# EasyEDA Pro project 万用表.eprj, schematic Schematic1

## Sheets
1 core: Board Name: 1.0版本-大表笔; Create Date: 2025-03-25; Page Name: core; Project Name: 天空星-简易数字万用表拓展版; Schematic Name: Schematic1; Update Date: 2025-03-25; Company: 嘉立创EDA; Page Size: A4; Version: V1.0
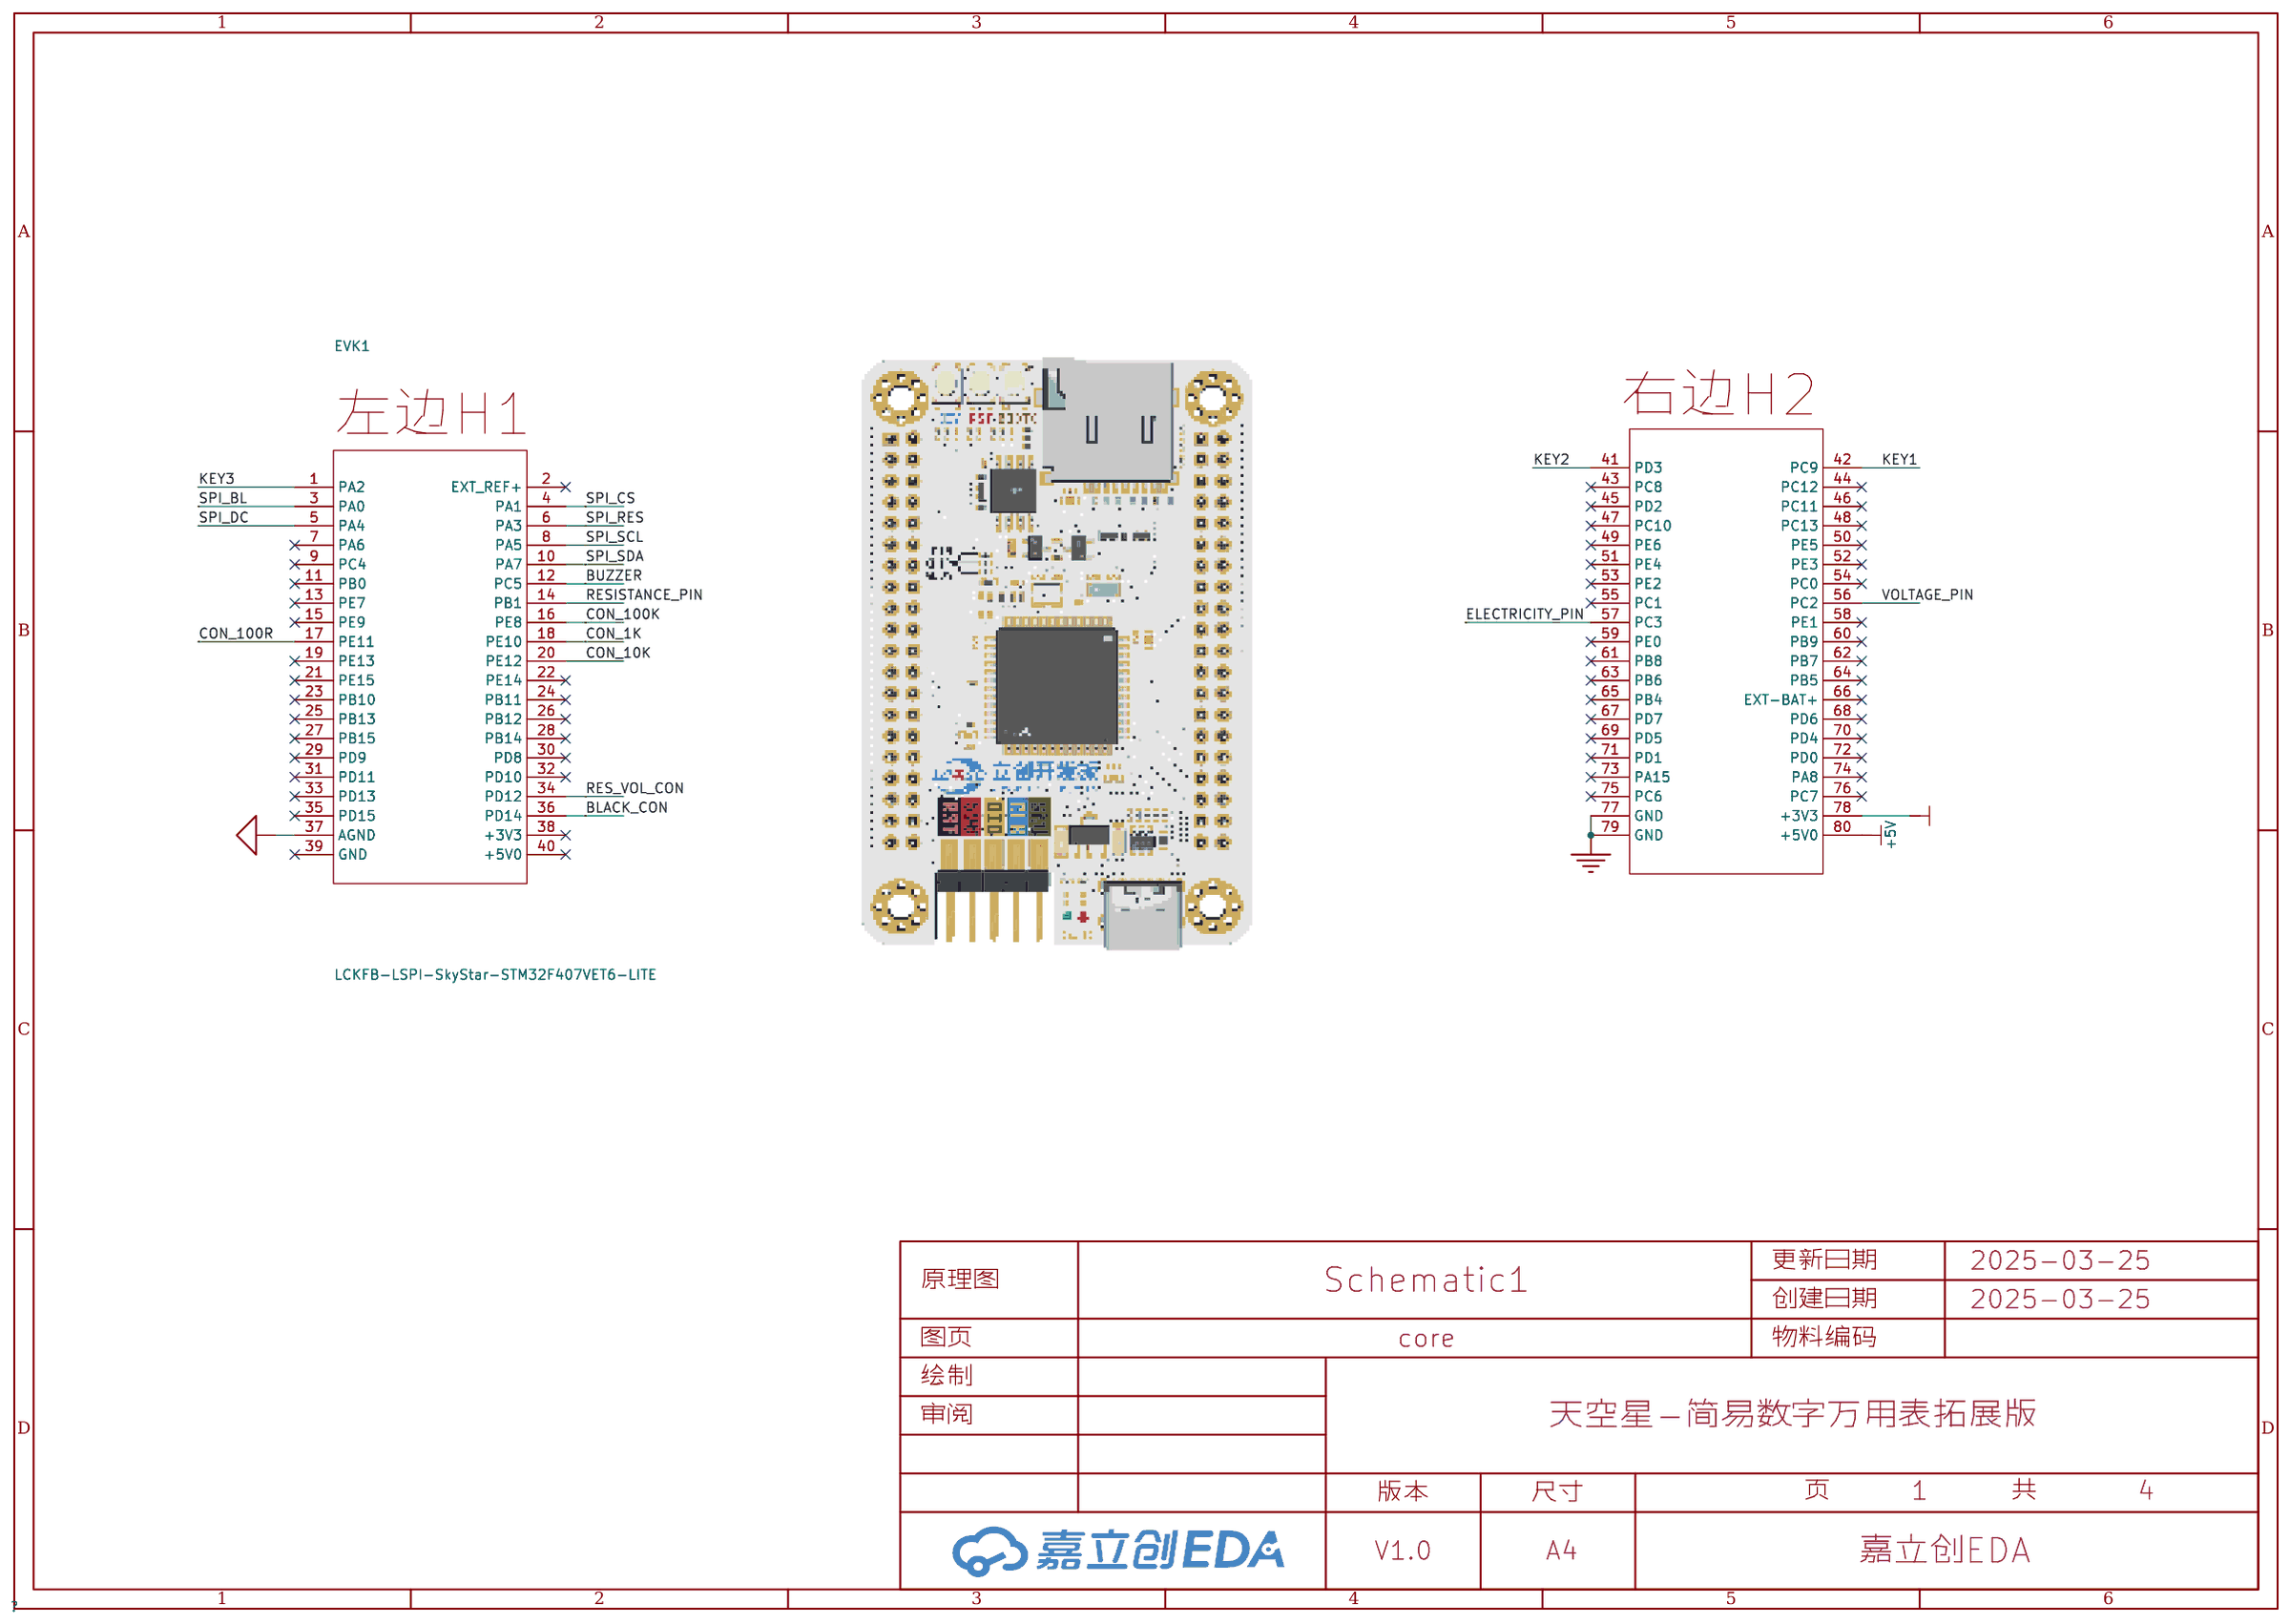
[diagram p0: core]
2 peripheral: Board Name: Board1; Page Name: peripheral
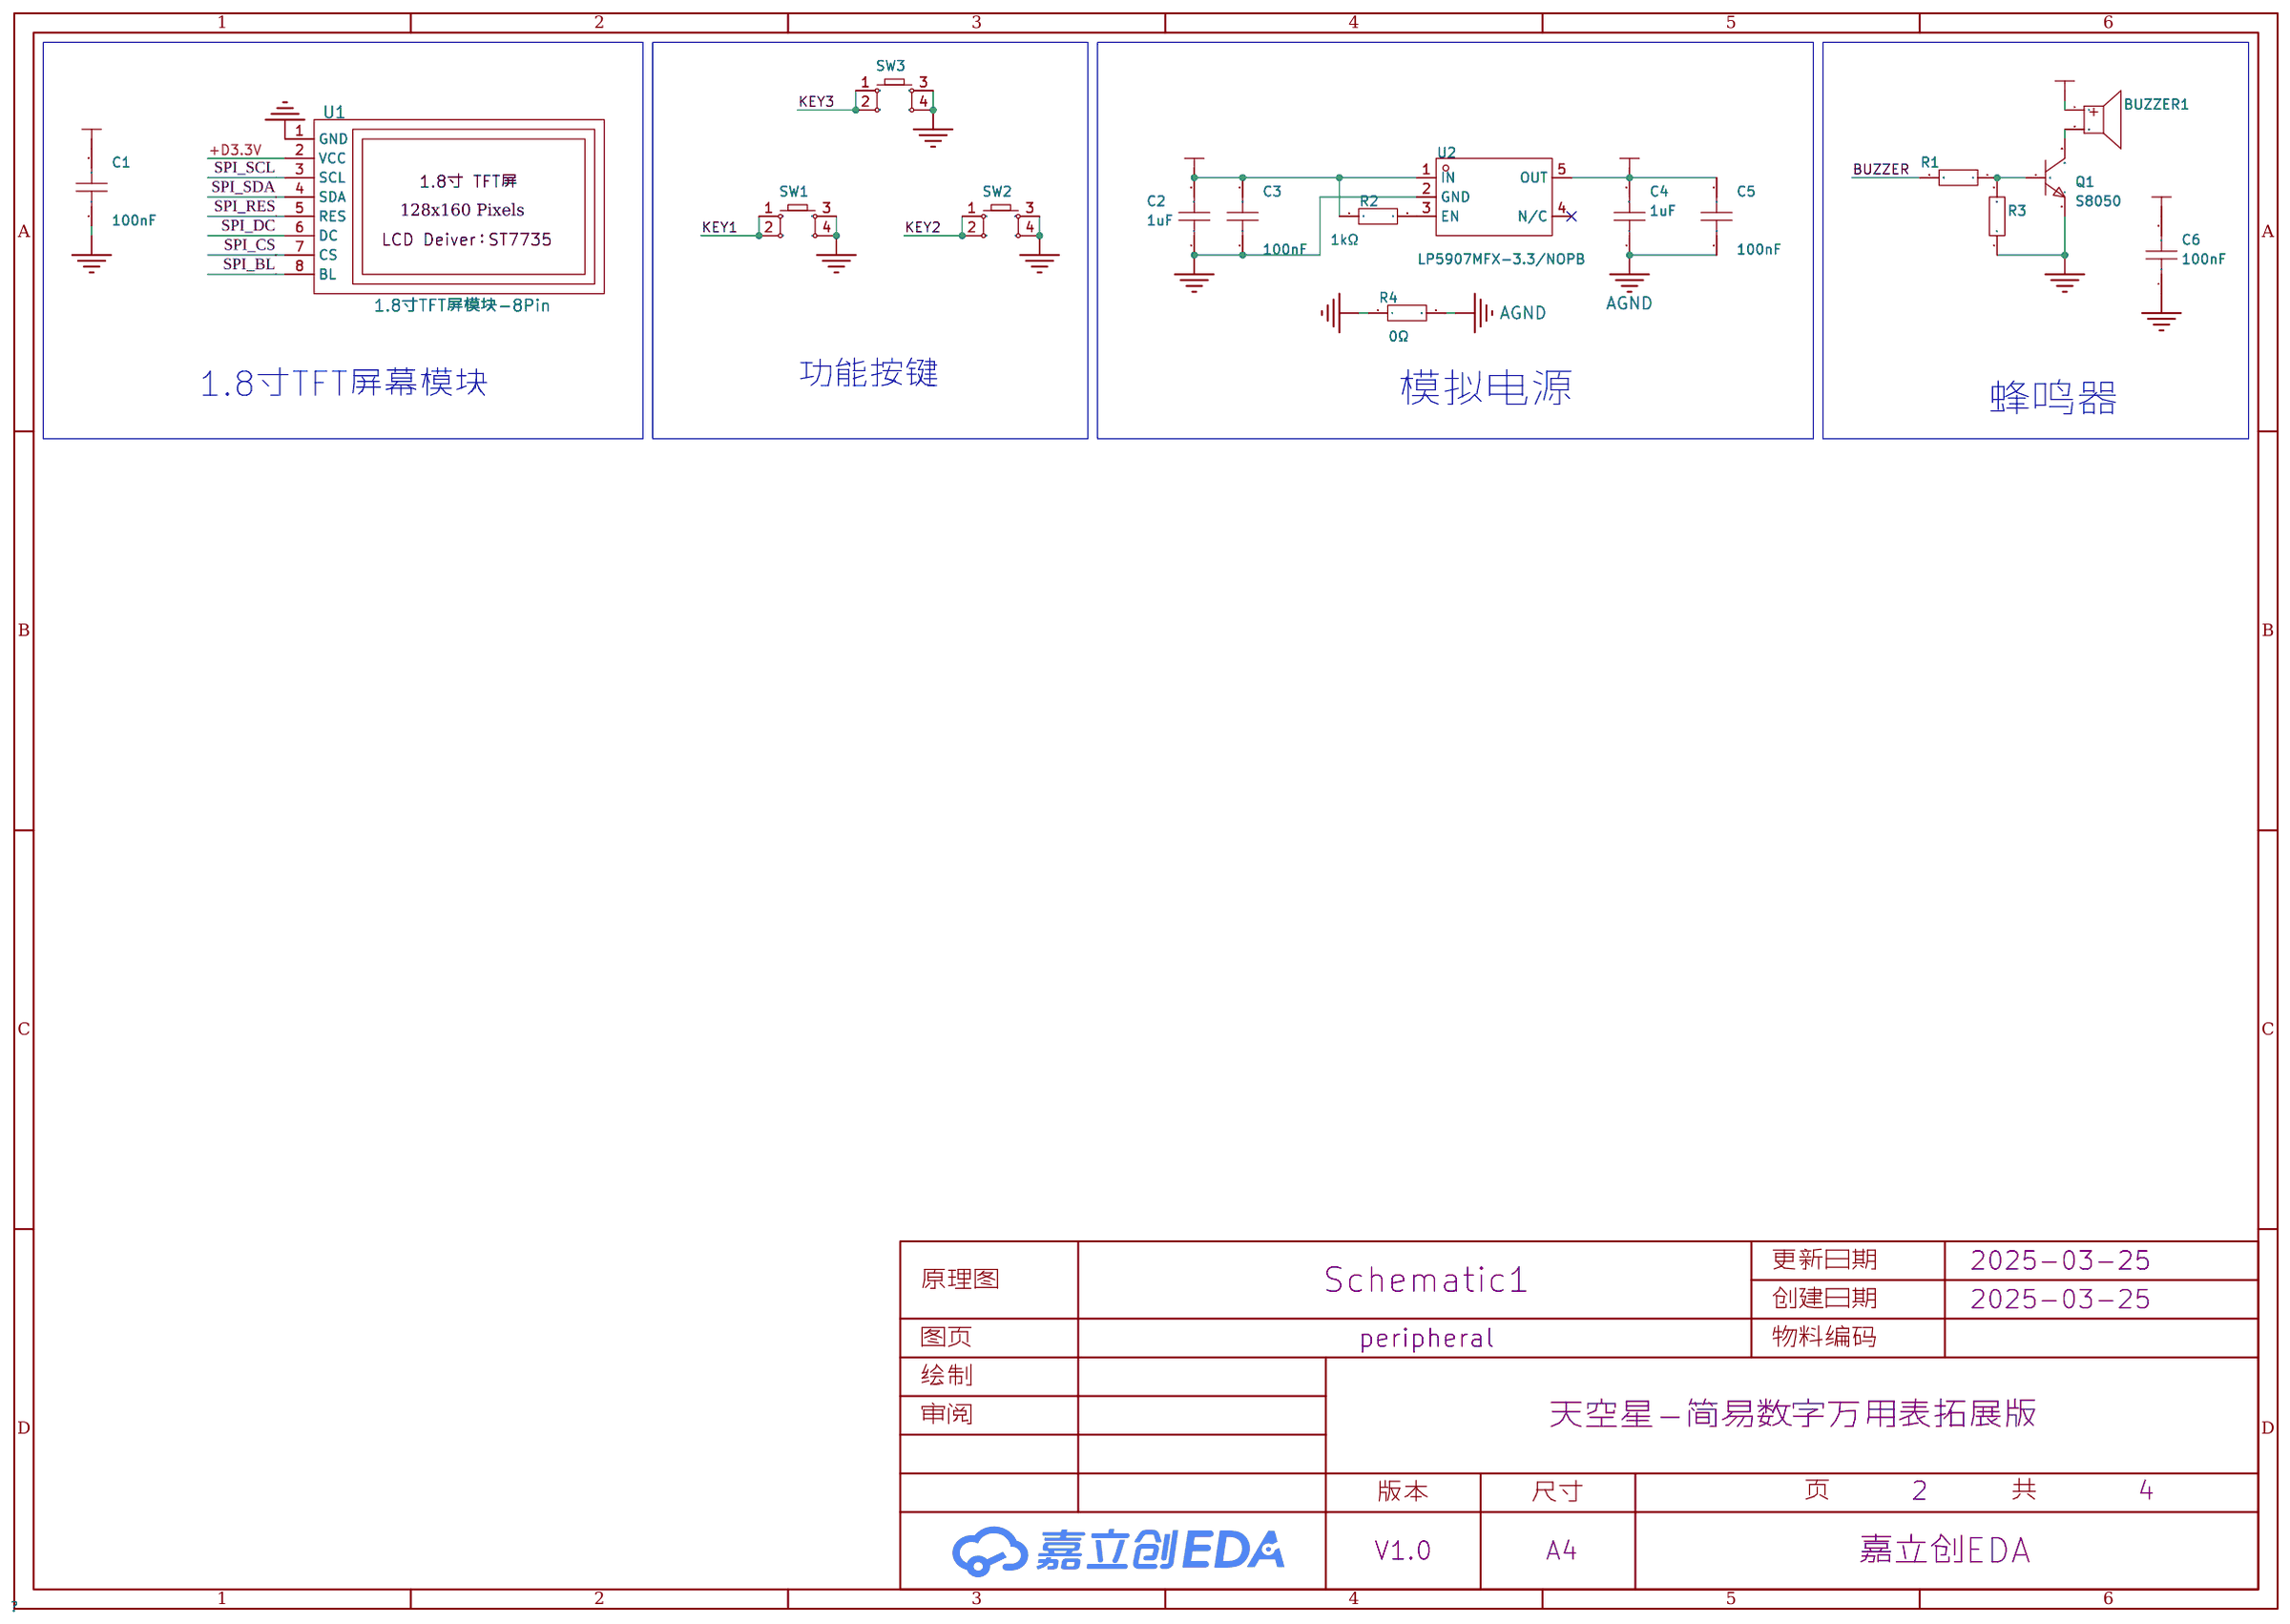
[diagram p1: peripheral]
3 control: Page Name: control
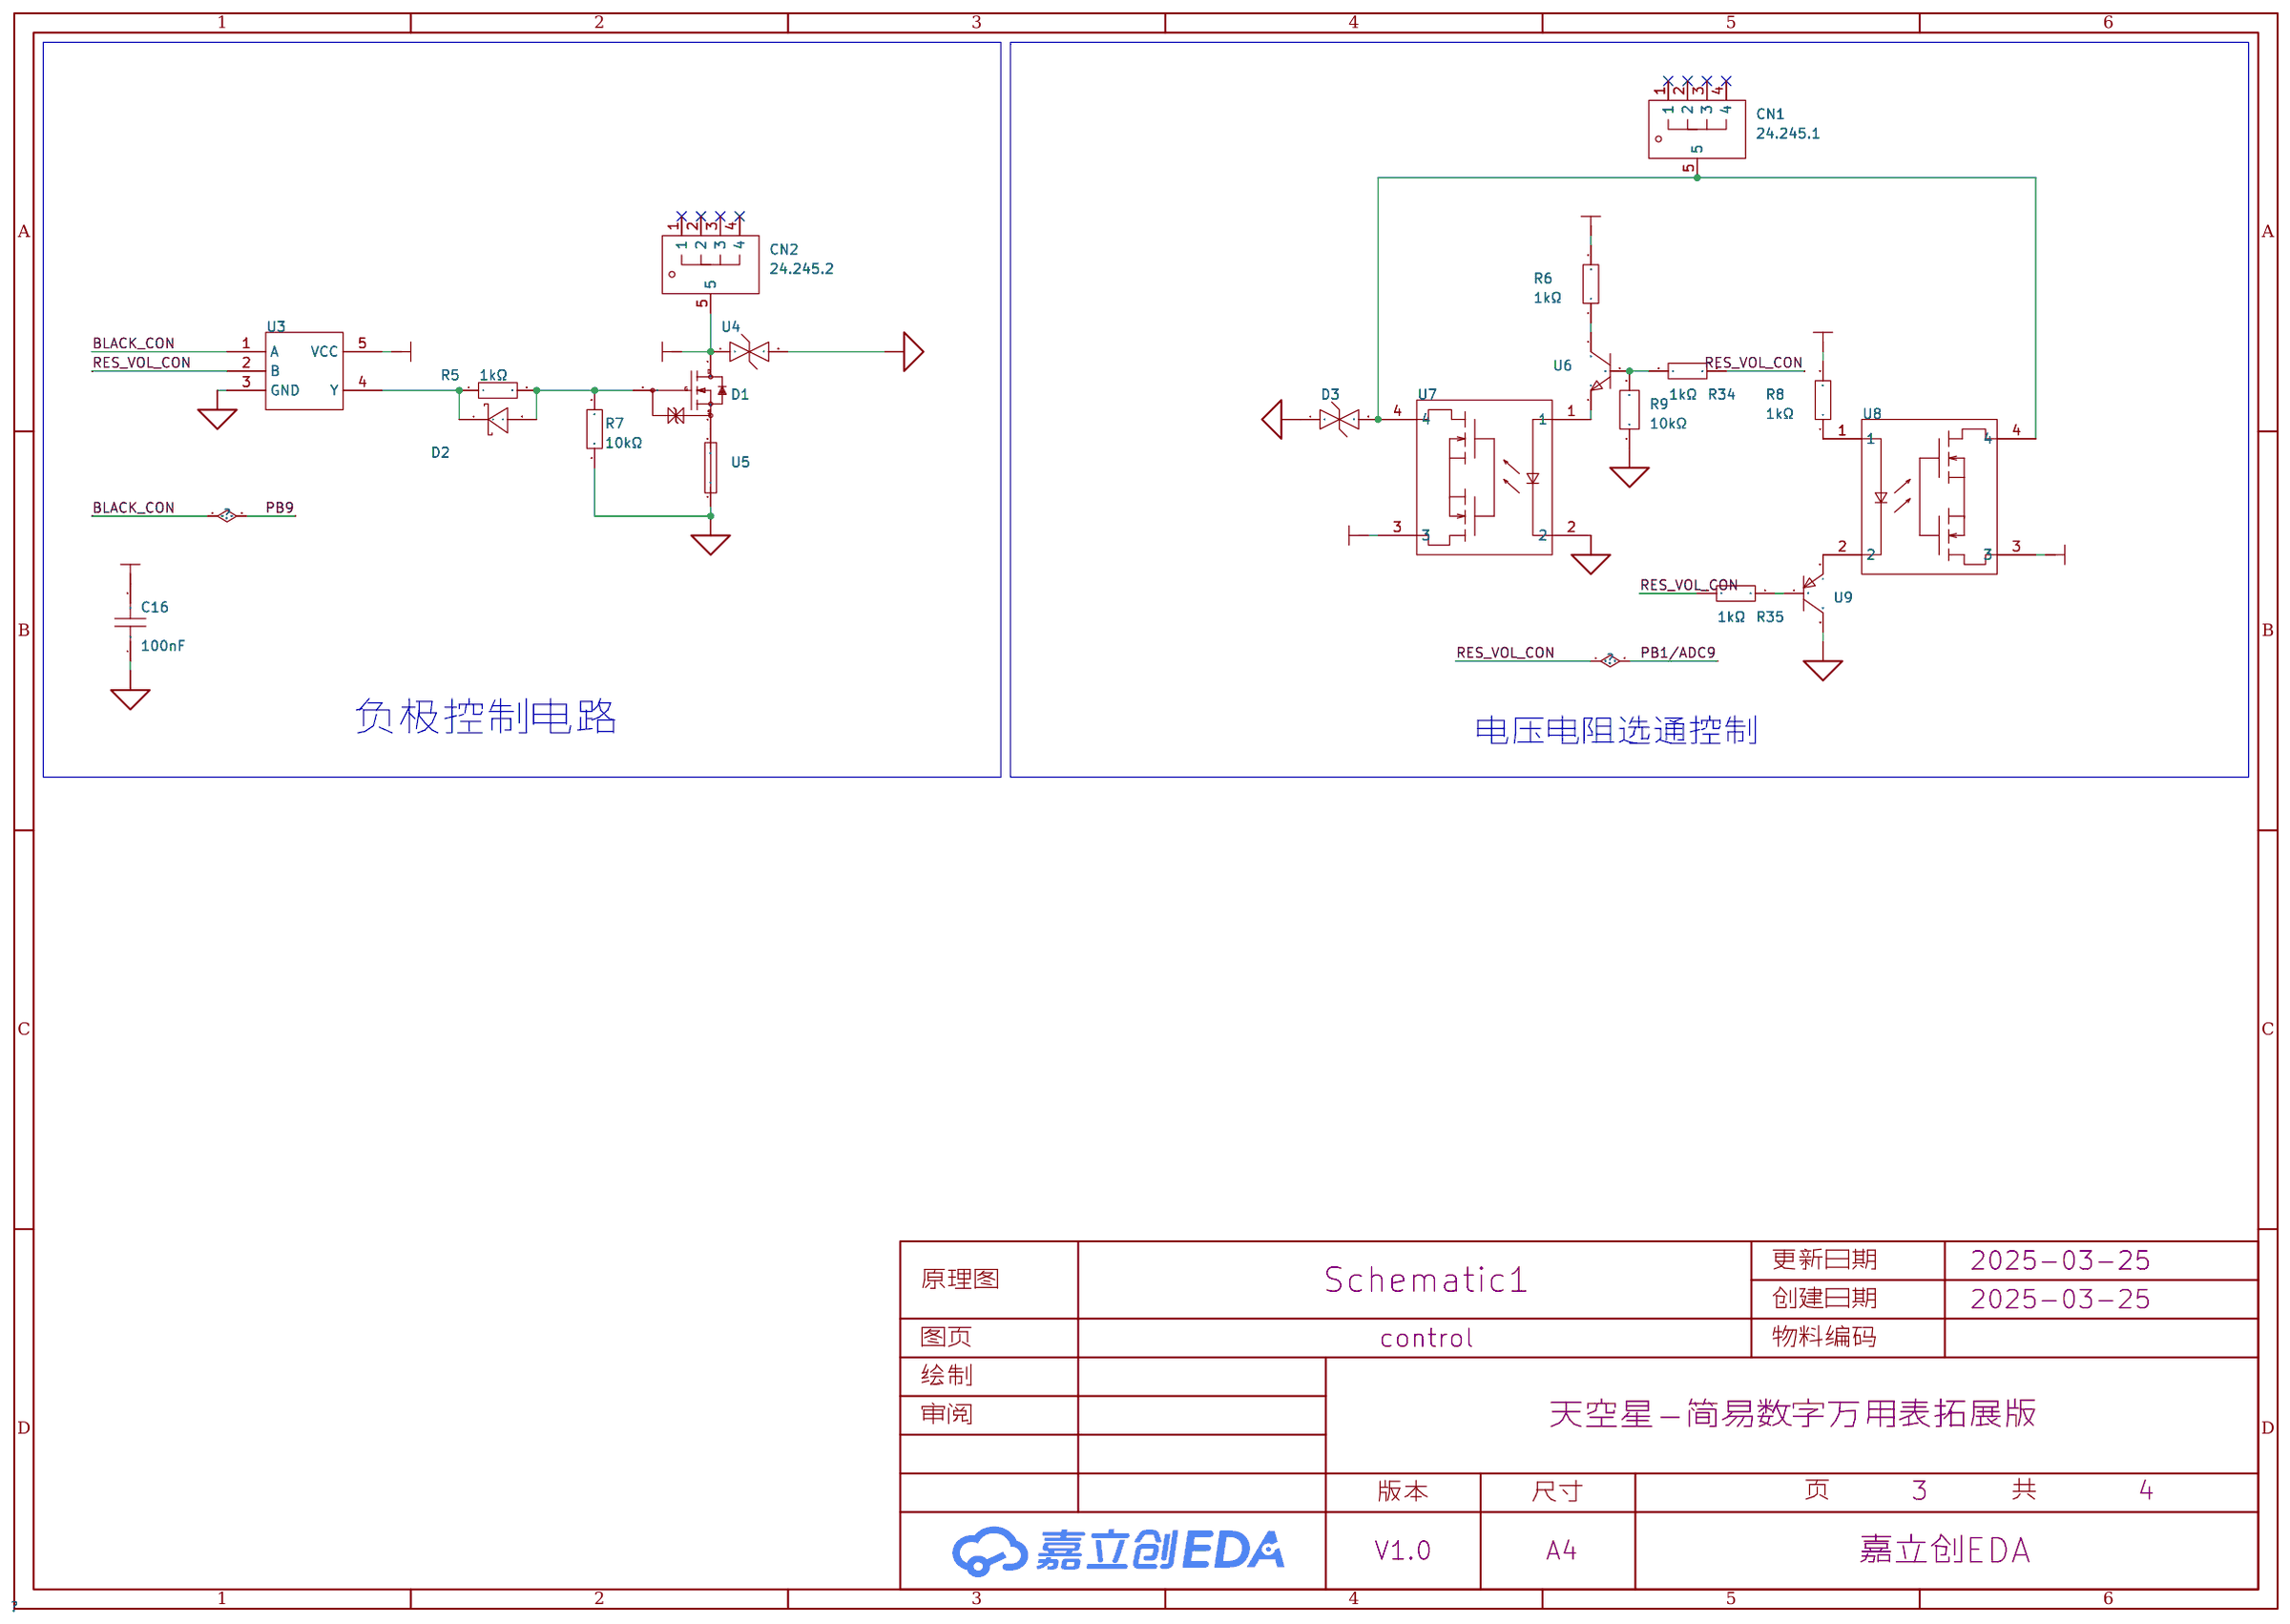
[diagram p2: control]
4 measure: Board Name: Board1; Page Name: measure
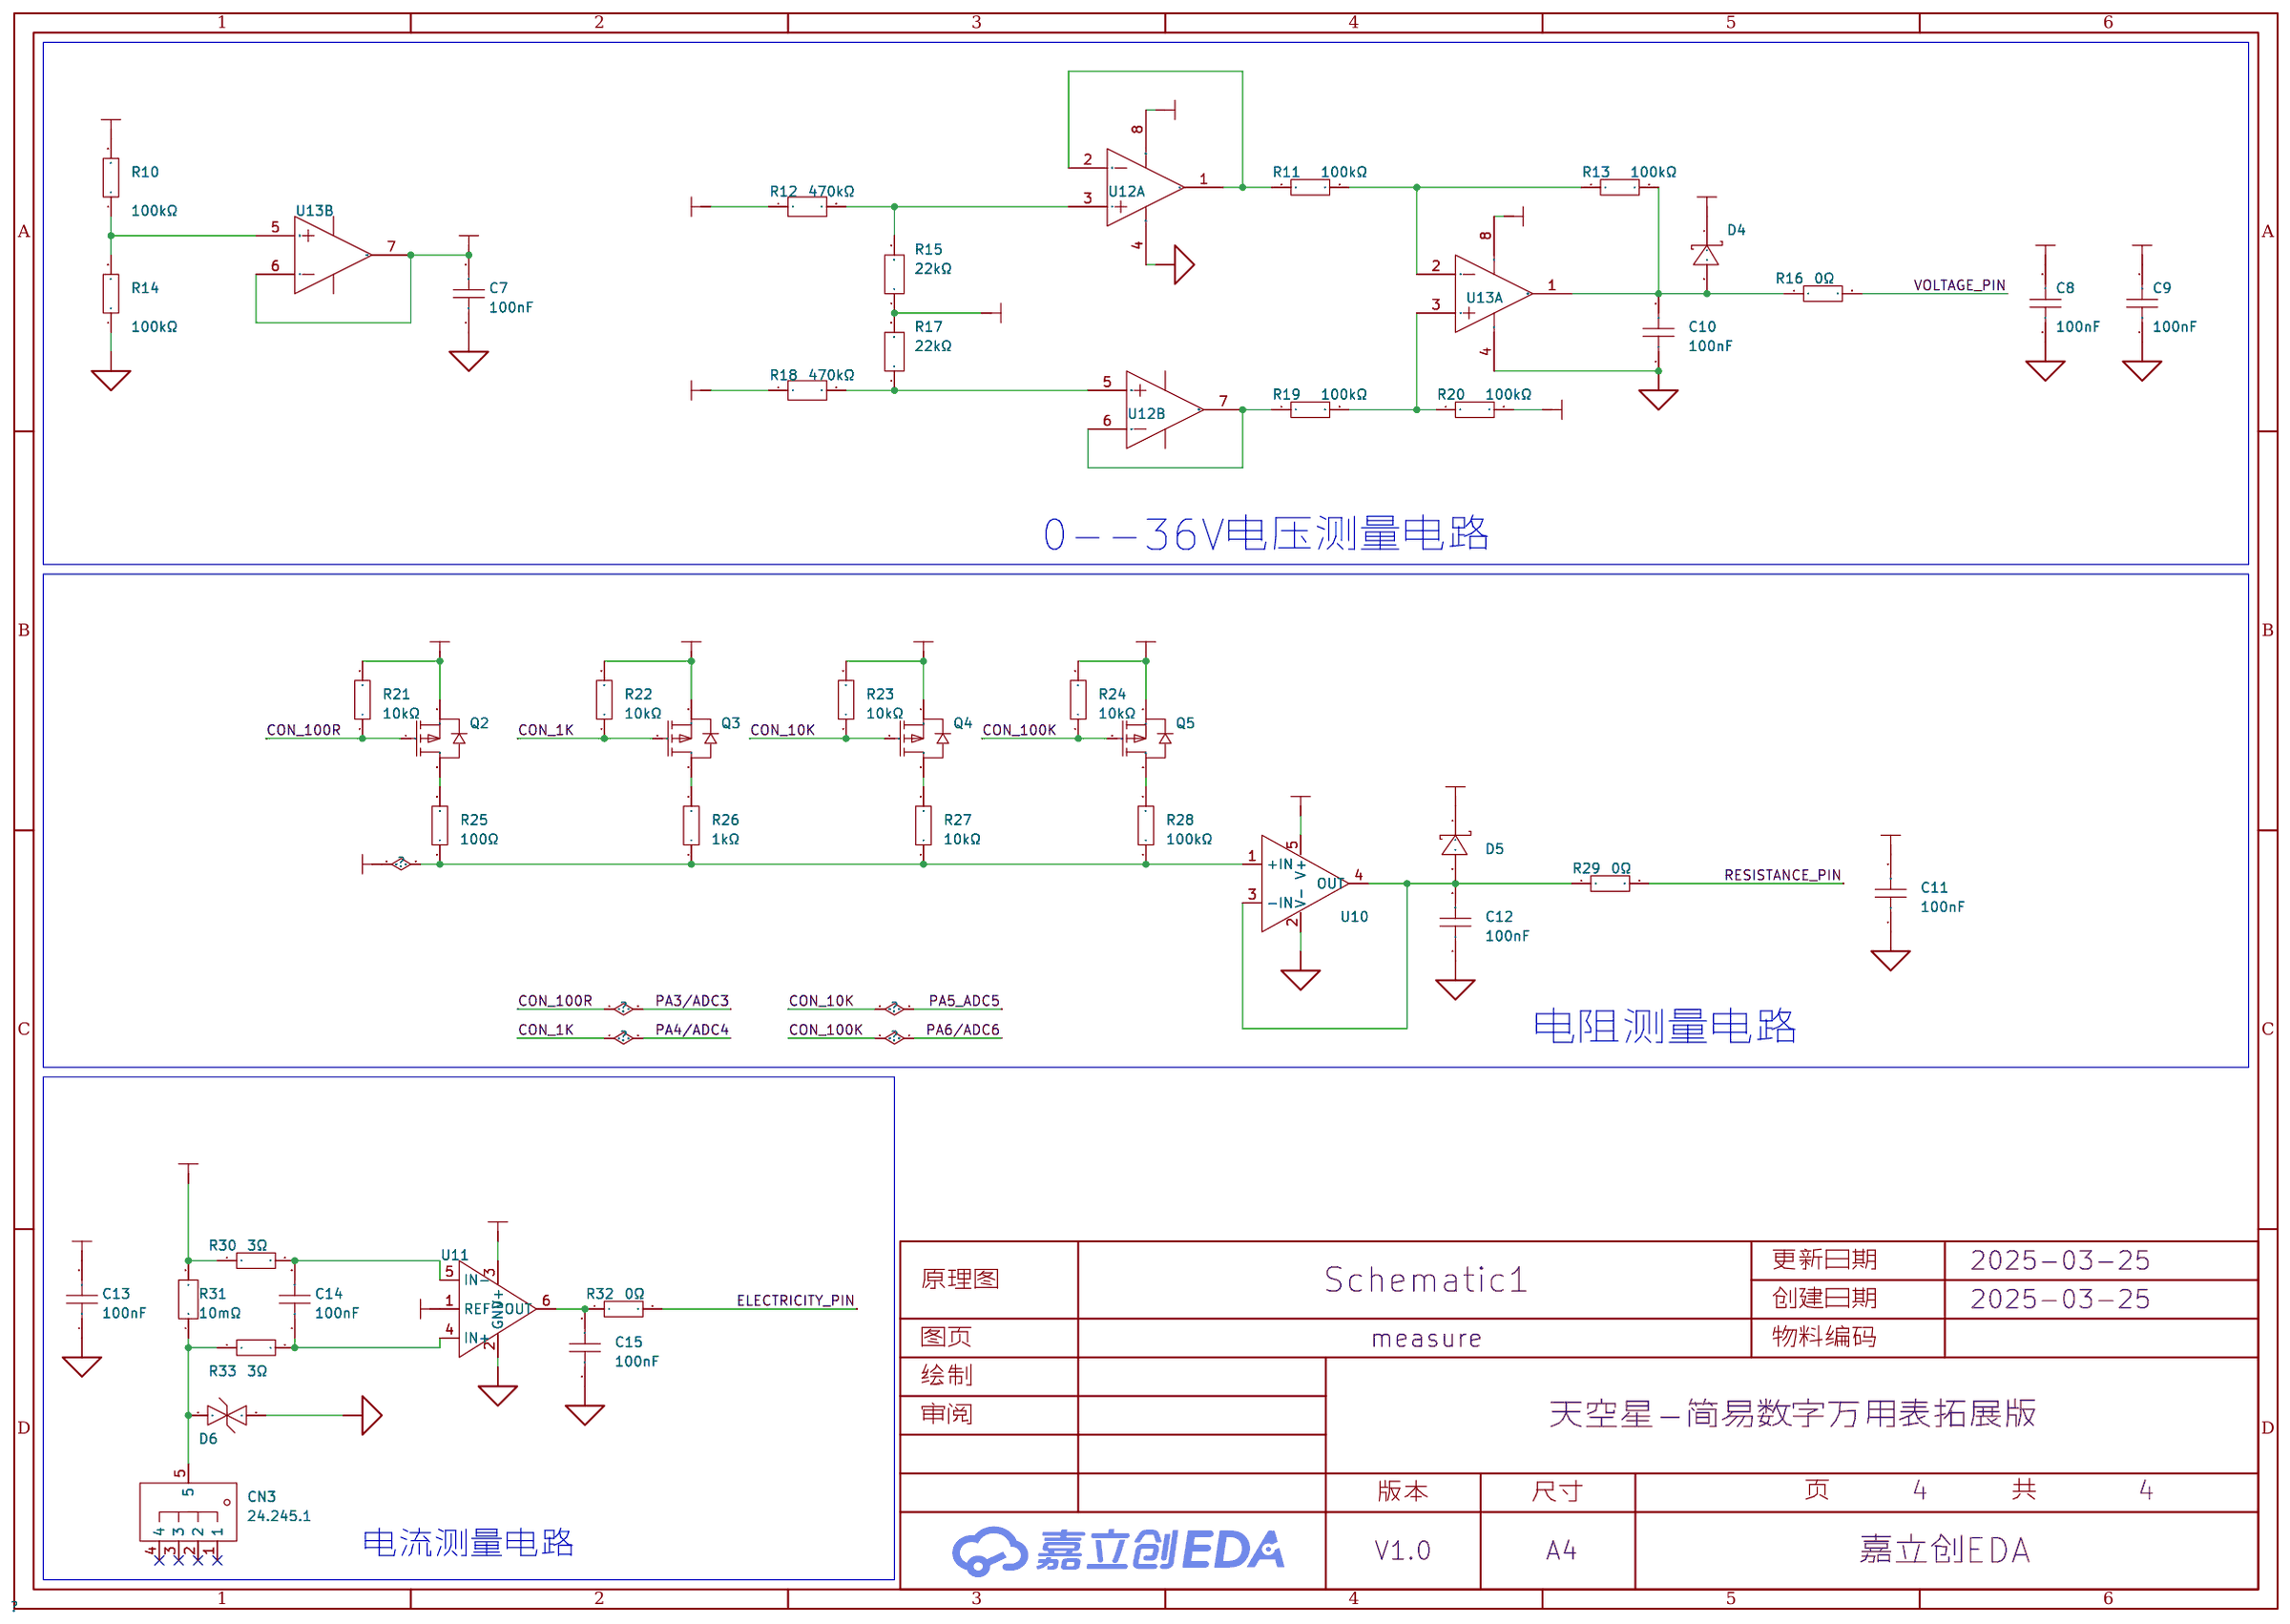
[diagram p3: measure]

## Parts
sheet control
C16  100nF  [C0603]
CN1  24.245.1  [ANT-TH_L33.0-W12.0_RED]
CN2  24.245.2  [ANT-TH_L33.0-W12.0_BLACK]
D1  SJD12C40L01  [SOD-123_L2.8-W1.8-LS3.7-BI]
D2  1N5819WS  [SOD-323_L1.8-W1.3-LS2.5-RD]
D3  SJD12C40L01  [SOD-123_L2.8-W1.8-LS3.7-BI]
R5  1kΩ  [R0603]
R6  1kΩ  [R0603]
R7  10kΩ  [R0603]
R8  1kΩ  [R0603]
R9  10kΩ  [R0603]
R34  1kΩ  [R0603]
R35  1kΩ  [R0603]
U3  SN74AHC1G08DBVR  [SOT-23-5_L3.0-W1.7-P0.95-LS2.8-BR]
U4  2N7002K  [SOT-23-3_L2.9-W1.3-P1.90-LS2.4-BL-1]
U5  BSMD0603-010-36V  [F0603]
U6  SS8050  [SOT-23-3_L2.9-W1.3-P1.90-LS2.4-BR]
U7  GAQY212GSX  [SOP-4_L4.3-W4.4-P2.54-LS6.8-TR]
U8  GAQY212GSX  [SOP-4_L4.3-W4.4-P2.54-LS6.8-TR]
U9  SS8550  [SOT-23-3_L2.9-W1.3-P1.90-LS2.4-BR]
sheet core
EVK1  LCKFB-LSPI-SkyStar-STM32F407VET6-LITE  [COMM-TH_LCKFB-LSPI-SKYSTAR-STM32F407VET6-LITE]
sheet measure
C7  100nF  [C0603]
C8  100nF  [C0603]
C9  100nF  [C0603]
C10  100nF  [C0603]
C11  100nF  [C0603]
C12  100nF  [C0603]
C13  100nF  [C0603]
C14  100nF  [C0603]
C15  100nF  [C0603]
CN3  24.245.1  [ANT-TH_L33.0-W12.0_RED]
D4  1N5819WS  [SOD-323_L1.8-W1.3-LS2.5-RD]
D5  1N5819WS  [SOD-323_L1.8-W1.3-LS2.5-RD]
D6  SJD12C40L01  [SOD-123_L2.8-W1.8-LS3.7-BI]
Q2  AO3401  [SOT-23-3_L2.9-W1.4-P1.90-LS2.6-BR]
Q3  AO3401  [SOT-23-3_L2.9-W1.4-P1.90-LS2.6-BR]
Q4  AO3401  [SOT-23-3_L2.9-W1.4-P1.90-LS2.6-BR]
Q5  AO3401  [SOT-23-3_L2.9-W1.4-P1.90-LS2.6-BR]
R10  100kΩ  [R0603]
R11  100kΩ  [R0603]
R12  470kΩ  [R0603]
R13  100kΩ  [R0603]
R14  100kΩ  [R0603]
R15  22kΩ  [R0603]
R16  0Ω  [R0603]
R17  22kΩ  [R0603]
R18  470kΩ  [R0603]
R19  100kΩ  [R0603]
R20  100kΩ  [R0603]
R21  10kΩ  [R0603]
R22  10kΩ  [R0603]
R23  10kΩ  [R0603]
R24  10kΩ  [R0603]
R25  100Ω  [R0603]
R26  1kΩ  [R0603]
R27  10kΩ  [R0603]
R28  100kΩ  [R0603]
R29  0Ω  [R0603]
R30  3Ω  [R0603]
R31  10mΩ  [RES-SMD_L6.4-W3.2-R2512]
R32  0Ω  [R0603]
R33  3Ω  [R0603]
U10  LMV321  [SOT-23-5_L2.9-W1.6-P0.95-LS2.8-TL]
U11  TP181A1-CR  [SC70-6_L2.1-W1.3-P0.65-LS2.3-BL]
U12  LMV358MM/TR  [MSOP-8_L3.0-W3.0-P0.65-LS5.0-BL]  (sections 1,2)
U13  LMV358MM/TR  [MSOP-8_L3.0-W3.0-P0.65-LS5.0-BL]  (sections 1,2)
sheet peripheral
BUZZER1  3kHz  [BUZ-TH_BD9.0-P5.00-D0.6-FD]
C1  100nF  [C0603]
C2  1uF  [C0603]
C3  100nF  [C0603]
C4  1uF  [C0603]
C5  100nF  [C0603]
C6  100nF  [C0603]
Q1  S8050  [SOT-23-3_L3.0-W1.7-P0.95-LS2.9-BR]
R1  10kΩ  [R0603]
R2  1kΩ  [R0603]
R3  10kΩ  [R0603]
R4  0Ω  [R0603]
SW1  TS-1009S-03826  [SW-SMD_4P-L4.5-W4.5-P3.00-LS7.0_TS-1009S-03826]
SW2  TS-1009S-03826  [SW-SMD_4P-L4.5-W4.5-P3.00-LS7.0_TS-1009S-03826]
SW3  TS-1009S-03826  [SW-SMD_4P-L4.5-W4.5-P3.00-LS7.0_TS-1009S-03826]
U1  1.8寸TFT屏模块-8Pin  [1.8寸TFT屏模块-8PIN]
U2  LP5907MFX-3.3/NOPB  [SOT-23-5_L3.0-W1.7-P0.95-LS2.8-BR]

## Library data of the parts
C1 C3 C5-C9 C11-C16 = CC0603KRX7R9BB104: 容值:100nF;精度:±10%;额定电压:50V;材质(温度系数):X7R;; LCSC Part Name: 100nF ±10% 50V; Supplier Part: C14663; Manufacturer: YAGEO(国巨); Supplier Footprint: 0603; JLCPCB Part Class: 基础库; Datasheet: https://atta.szlcsc.com/upload/public/pdf/source/20180910/C282072_33301C7F631E79921B82A8DAC6BCC5B3.pdf; Supplier: LCSC; Tolerance: ±10%; Voltage Rated: 50V; Temperature Coefficient: X7R
CN1 CN3 = 24.245.1: Supplier Part: C7437326; Manufacturer: AMASS(艾迈斯); JLCPCB Part Class: 扩展库; Datasheet: https://atta.szlcsc.com/upload/public/pdf/source/20230719/D60EC65C28553445F4ABD10C941B2E80.pdf; Supplier: LCSC
CN2 = 24.245.2: Supplier Part: C7437327; Manufacturer: AMASS(艾迈斯); JLCPCB Part Class: 扩展库; Datasheet: https://atta.szlcsc.com/upload/public/pdf/source/20230719/D60EC65C28553445F4ABD10C941B2E80.pdf; Supplier: LCSC
D1 D3 D6 = SJD12C40L01: 极性:双向;反向截止电压(Vrwm):40V;最大钳位电压:64.5V;峰值脉冲电流(Ipp)@10/1000us:3.1A;击穿电压:44.4V;; LCSC Part Name: 双向ESD; Supplier Part: C313287; Manufacturer: Brightking(君耀电子); Supplier Footprint: SOD-123S; JLCPCB Part Class: 扩展库; Datasheet: https://atta.szlcsc.com/upload/public/pdf/source/20190308/C313298_C5F5DA7B871929800C41255070D52D63.pdf; Supplier: LCSC; polarity: 双向; Reverse Stand-Off Voltage (Vrwm): 40V; Maximum Clamping Voltage: 64.5V; Peak Pulse Current (Ipp)@10/1000us: 3.1A; Breakdown Voltage: 44.4V; Number of Lines: 单路; Type: ESD
D2 D4 D5 = 1N5819WS_C191023: 正向压降(Vf):600mV@1A;直流反向耐压(Vr):40V;平均整流电流(Io):1A;; LCSC Part Name: 电压:40V 电流:1A; Supplier Part: C191023; Manufacturer: Hottech(合科泰); Supplier Footprint: SOD-323; JLCPCB Part Class: 基础库; Datasheet: https://atta.szlcsc.com/upload/public/pdf/source/20220428/3CB86FD8D28D653594B4E35F9D5AEFD9.pdf; Supplier: LCSC; Forward Voltage (Vf@If): 600mV@1A; Reverse Voltage (Vr): 40V; Average Rectified Current (Io): 1A
R5 = RC0603FR-071KL: 电阻类型:厚膜电阻;阻值:1kΩ;精度:±1%;功率:100mW;工作电压:75V;温度系数:±100ppm/℃;; LCSC Part Name: 厚膜电阻 1kΩ ±1% 100mW; Supplier Part: C22548; Manufacturer: YAGEO(国巨); Supplier Footprint: 0603; JLCPCB Part Class: Extended Part; Datasheet: https://atta.szlcsc.com/upload/public/pdf/source/20180316/70C0E2BDAE7FCC62C531A5A58D202EE1.pdf; Supplier: LCSC; Type: 厚膜电阻; Tolerance: ±1%; Power(Watts): 100mW; Overload Voltage (Max): 75V; Temperature Coefficient: ±100ppm/℃; Operating Temperature Range: -55℃~+155℃; Voltage-Supply(Max): 75V; Operating Temperature: -55℃~+155℃
R6 R8 R34 R35 = RC0603FR-071KL: 电阻类型:厚膜电阻;阻值:1kΩ;精度:±1%;功率:100mW;最大工作电压:75V;温度系数:±100ppm/℃;; LCSC Part Name: 厚膜电阻 1kΩ ±1% 100mW; Supplier Part: C22548; Manufacturer: YAGEO(国巨); Supplier Footprint: 0603; JLCPCB Part Class: 扩展库; Datasheet: https://atta.szlcsc.com/upload/public/pdf/source/20180316/70C0E2BDAE7FCC62C531A5A58D202EE1.pdf; Supplier: LCSC; Type: 厚膜电阻; Tolerance: ±1%; Power(Watts): 100mW; Overload Voltage (Max): 75V; Temperature Coefficient: ±100ppm/℃; Operating Temperature Range: -55℃~+155℃
R7 R21-R24 = 0603WAF1002T5E: 电阻类型:厚膜电阻;阻值:10kΩ;精度:±1%;功率:100mW;最大工作电压:75V;温度系数:±100ppm/℃;; LCSC Part Name: 厚膜电阻 10kΩ ±1% 100mW; Supplier Part: C25804; Manufacturer: UNI-ROYAL(厚声); Supplier Footprint: 0603; JLCPCB Part Class: 基础库; Datasheet: https://atta.szlcsc.com/upload/public/pdf/source/20200306/C422600_1E6D84923E4A46A82E41ADD87F860B5C.pdf; Supplier: LCSC; Type: 厚膜电阻; Tolerance: ±1%; Power(Watts): 100mW; Overload Voltage (Max): 75V; Temperature Coefficient: ±100ppm/℃; Operating Temperature Range: -55℃~+155℃
R9 = FRC0603J103TS: 电阻类型:厚膜电阻;阻值:10kΩ;精度:±5%;功率:100mW;最大工作电压:75V;温度系数:±100ppm/℃;; LCSC Part Name: 10kΩ ±5% 100mW 厚膜电阻; Supplier Part: C2930027; Manufacturer: FOJAN(富捷); Supplier Footprint: 0603; JLCPCB Part Class: 扩展库; Datasheet: https://atta.szlcsc.com/upload/public/pdf/source/20211221/925EC7D7225764EE0046F22065062C87.pdf; Supplier: LCSC; Type: 厚膜电阻; Tolerance: ±5%; Power(Watts): 100mW; Overload Voltage (Max): 75V; Temperature Coefficient: ±100ppm/℃; Operating Temperature Range: -55℃~+155℃
U3 = SN74AHC1G08DBVR: 逻辑类型:与门;通道数:1;电源电压:2V~5.5V;静态电流(最大值):1uA;最大传播延迟:7.9ns@5V,50pF;; Supplier Part: C7467; Manufacturer: TI(德州仪器); Supplier Footprint: SOT-23-5; JLCPCB Part Class: 扩展库; Datasheet: https://www.ti.com/cn/lit/gpn/sn74ahc1g08; Supplier: LCSC; Logic Gate Type: 与门; Number of Channels: 1; Supply Voltage: 2V~5.5V; Quiescent Current (Max): 1uA; Sink Current: 8mA; Source Current: 8mA; High Level Range (VIH): 1.5V~3.85V; Low Level Range (VIL): 500mV~1.65V; Series: 74AHC系列; Propagation Delay Time: 7.9ns@5V,50pF; Operating Temperature: -55℃~+125℃
U4 = 2N7002K_C3008053: 类型:1个N沟道;漏源电压(Vdss):60V;连续漏极电流(Id):300mA;功率(Pd):350mW;导通电阻(RDS(on)@Vgs,Id):2.2Ω@10V,300mA;阈值电压(Vgs(th)@Id):1.6V@250uA;; LCSC Part Name: 1个N沟道 耐压:60V 电流:300mA; Supplier Part: C3008053; Manufacturer: MSKSEMI(美森科); Supplier Footprint: SOT-23; JLCPCB Part Class: Extended Part; Datasheet: https://atta.szlcsc.com/upload/public/pdf/source/20231010/5AB8D059FA255FE9F5E2F13E941A7E6F.pdf; Supplier: LCSC; Type: 1个N沟道; Drain Source Voltage (Vdss): 60V; Continuous Drain Current (Id): 300mA; Power Dissipation (Pd): 350mW; Drain Source On Resistance (RDS(on)@Vgs,Id): 2.2Ω@10V,300mA; Gate Threshold Voltage (Vgs(th)@Id): 1.6V@250uA; Total Gate Charge (Qg@Vgs): 3.7nC@10V; Input Capacitance (Ciss@Vds): 25.5pF@30V; Reverse Transfer Capacitance (Crss@Vds): 7.8pF@30V; Operating Temperature: -50℃~+150℃@(Tj)
U5 = BSMD0603-010-36V: 最大电压:36V;最大电流:40A;保持电流:100mA;跳闸电流:300mA;; LCSC Part Name: 36V 0.1A 0603自恢复; Supplier Part: C18377604; Manufacturer: BHFUSE(佰宏); Supplier Footprint: 0603; JLCPCB Part Class: 扩展库; Datasheet: https://atta.szlcsc.com/upload/public/pdf/source/20231016/7E77207D94D4ADACC402A52F6B671663.pdf; Supplier: LCSC; Operating Voltage (Max): 36V; Current Rating (Max): 40A; Hold Current: 100mA; Trip Current: 300mA; Power Dissipation: 500mW; Resistance - Initial (Ri) (Min): 900mΩ; Resistance - Post Trip (R1) (Max): 8Ω; Maximum Time to Trip: 600ms; Operating Temperature: -40℃~+85℃
U6 = SS8050_C7420370: 晶体管类型:NPN;集电极电流(Ic):1.5A;集射极击穿电压(Vceo):25V;功率(Pd):300mW;直流电流增益(hFE@Ic,Vce):120@100mA,1.0V;; LCSC Part Name: 耐压:25V 电流:1.5A NPN H档 200-350; Supplier Part: C7420370; Manufacturer: 宏迦橙; Supplier Footprint: SOT-23; JLCPCB Part Class: Extended Part; Datasheet: https://atta.szlcsc.com/upload/public/pdf/source/20231222/9C4050A7669EB24B3ACD0418218817FD.pdf; Supplier: LCSC; Transistor Type: NPN; Collector Current (Ic): 1.5A; Collector-Emitter Breakdown Voltage (Vceo): 25V; Power Dissipation (Pd): 300mW; DC Current Gain (hFE@Ic,Vce): 120@100mA,1.0V; Transition Frequency (fT): 100MHz; Collector Cut-Off Current (Icbo): 100nA; Collector-Emitter Saturation Voltage (VCE(sat)@Ic,Ib): 500mV@800mA,80mA; Operating Temperature: -55℃~+150℃
U7 U8 = GAQY212GSX: 继电器触点形式:1 Form A (SPST-NO);适用负载类型:AC,DC;正向压降:1.32V;负载电压:60V;连续负载电流:1A;导通电阻:180mΩ;; LCSC Part Name: 固态继电器; Supplier Part: C19271988; Manufacturer: SUPSiC(国晶微半导体); Supplier Footprint: SOP-4; JLCPCB Part Class: 扩展库; Datasheet: https://atta.szlcsc.com/upload/public/pdf/source/20231201/71CDF33FACEA97DA9648A52C46D9B1CB.pdf; Supplier: LCSC; Relay Contact Form: 1 Form A (SPST-NO); Load Type: AC,DC; Input Forward Voltage: 1.32V; Voltage - Load: 60V; Continuous Load Current: 1A; On Resistance: 180mΩ; Isolation Voltage(rms): 1.5kV; Turn-on time: 350us; Turn-off time: 100us
U9 = SS8550_C7420371: 晶体管类型:PNP;集电极电流(Ic):1.5A;集射极击穿电压(Vceo):25V;功率(Pd):300mW;直流电流增益(hFE@Ic,Vce):120@100mA,1.0V;; LCSC Part Name: 耐压:25V 电流:1.5A PNP H档 200-350; Supplier Part: C7420371; Manufacturer: 宏迦橙; Supplier Footprint: SOT-23; JLCPCB Part Class: 扩展库; Datasheet: https://atta.szlcsc.com/upload/public/pdf/source/20231222/5BDA6DBF3A79C59009F81F0EEE6F8969.pdf; Supplier: LCSC; Transistor Type: PNP; Collector Current (Ic): 1.5A; Collector-Emitter Breakdown Voltage (Vceo): 25V; Power Dissipation (Pd): 300mW; DC Current Gain (hFE@Ic,Vce): 120@100mA,1.0V; Transition Frequency (fT): 100MHz; Collector Cut-Off Current (Icbo): 100nA; Collector-Emitter Saturation Voltage (VCE(sat)@Ic,Ib): 500mV@800mA,80mA; Operating Temperature: -55℃~+150℃
EVK1 = LCKFB-LSPI-SkyStar-STM32F407VET6-LITE: 单板,不送排针; LCSC Part Name: 立创·天空星开发板-STM32F407VET6-青春版; Supplier Part: C22370035; Manufacturer: 立创开发板; JLCPCB Part Class: Extended Part; Datasheet: https://atta.szlcsc.com/upload/public/pdf/source/20241206/0691F39A1CCEC0DBD54409B5B1AC1616.pdf; Supplier: LCSC
C10 = CL10B104KB8NNNC: 容值:100nF;精度:±10%;额定电压:50V;材质(温度系数):X7R;; LCSC Part Name: 100nF ±10% 50V; Supplier Part: C1591; Manufacturer: SAMSUNG(三星); Supplier Footprint: 0603; JLCPCB Part Class: 扩展库; Datasheet: https://atta.szlcsc.com/upload/public/pdf/source/20160218/1457707763339.pdf; Supplier: LCSC; Tolerance: ±10%; Voltage Rated: 50V; Temperature Coefficient: X7R
Q2-Q5 = AO3401_C727156: 类型:1个P沟道;漏源电压(Vdss):30V;连续漏极电流(Id):4.2A;功率(Pd):350mW;导通电阻(RDS(on)@Vgs,Id):65mΩ@10V,4.2A;阈值电压(Vgs(th)@Id):1.3V@250uA;; LCSC Part Name: 1个P沟道 耐压:30V 电流:4.2A; Supplier Part: C727156; Manufacturer: TWGMC(台湾迪嘉); Supplier Footprint: SOT-23; JLCPCB Part Class: 扩展库; Datasheet: https://atta.szlcsc.com/upload/public/pdf/source/20200827/C727156_6E081BBEEFBC6B8FEE164CB196B0AF30.pdf; Supplier: LCSC; Type: 1个P沟道; Drain Source Voltage (Vdss): 30V; Continuous Drain Current (Id): 4.2A; Power Dissipation (Pd): 350mW; Drain Source On Resistance (RDS(on)@Vgs,Id): 65mΩ@10V,4.2A; Gate Threshold Voltage (Vgs(th)@Id): 1.3V@250uA
R10 R11 R13 R14 R19 R20 R28 = RT0603BRD07100KL: 电阻类型:薄膜电阻;阻值:100kΩ;精度:±0.1%;功率:100mW;最大工作电压:75V;温度系数:±25ppm/℃;; LCSC Part Name: 薄膜电阻 100kΩ ±0.1% 100mW; Supplier Part: C122538; Manufacturer: YAGEO(国巨); Supplier Footprint: 0603; JLCPCB Part Class: 扩展库; Datasheet: https://atta.szlcsc.com/upload/public/pdf/source/20170721/C122538_1500619326323834092.pdf; Supplier: LCSC; Type: 薄膜电阻; Tolerance: ±0.1%; Power(Watts): 100mW; Overload Voltage (Max): 75V; Temperature Coefficient: ±25ppm/℃; Operating Temperature Range: -55℃~+155℃
R12 R18 = ERJ3RED474V: 电阻类型:厚膜电阻;阻值:470kΩ;精度:±0.5%;功率:100mW;最大工作电压:-;温度系数:±100ppm/℃;; LCSC Part Name: 470kΩ ±0.5% 100mW 厚膜电阻; Supplier Part: C416762; Manufacturer: PANASONIC(松下); Supplier Footprint: 0603; JLCPCB Part Class: 扩展库; Datasheet: https://atta.szlcsc.com/upload/public/pdf/source/20190902/C416762_14A9F79266547C35AAE9E83EA7A3C862.pdf; Supplier: LCSC; Type: 厚膜电阻; Tolerance: ±0.5%; Power(Watts): 100mW; Temperature Coefficient: ±100ppm/℃; Operating Temperature Range: -55℃~+155℃
R15 R17 = RT0603BRE0722KL: 电阻类型:薄膜电阻;阻值:22kΩ;精度:±0.1%;功率:100mW;最大工作电压:75V;温度系数:±50ppm/℃;; LCSC Part Name: 薄膜电阻 22kΩ ±0.1% 100mW; Supplier Part: C705830; Manufacturer: YAGEO(国巨); Supplier Footprint: 0603; JLCPCB Part Class: 扩展库; Datasheet: https://atta.szlcsc.com/upload/public/pdf/source/20200720/C705830_92BEC21E0D0843401711A7D848C438F2.pdf; Supplier: LCSC; Type: 薄膜电阻; Tolerance: ±0.1%; Power(Watts): 100mW; Overload Voltage (Max): 75V; Temperature Coefficient: ±50ppm/℃; Operating Temperature Range: -55℃~+155℃
R4 R16 R29 R32 = 0603WAF0000T5E: 电阻类型:厚膜电阻;阻值:0Ω;精度:±1%;功率:100mW;最大工作电压:75V;; LCSC Part Name: 0Ω ±1% 100mW 厚膜电阻; Supplier Part: C21189; Manufacturer: UNI-ROYAL(厚声); Supplier Footprint: 0603; JLCPCB Part Class: 基础库; Datasheet: https://atta.szlcsc.com/upload/public/pdf/source/20200306/C422600_1E6D84923E4A46A82E41ADD87F860B5C.pdf; Supplier: LCSC; Type: 厚膜电阻; Tolerance: ±1%; Power(Watts): 100mW; Overload Voltage (Max): 75V; Operating Temperature Range: -55℃~+155℃
R25 = RT0603BRD07100RL: 电阻类型:薄膜电阻;阻值:100Ω;精度:±0.1%;功率:100mW;最大工作电压:75V;温度系数:±25ppm/℃;; LCSC Part Name: 薄膜电阻 100Ω ±0.1% 100mW; Supplier Part: C122970; Manufacturer: YAGEO(国巨); Supplier Footprint: 0603; JLCPCB Part Class: 扩展库; Datasheet: https://atta.szlcsc.com/upload/public/pdf/source/20180716/C95646_694A11296E8D6C27B0592E54BC4097D1.pdf; Supplier: LCSC; Type: 薄膜电阻; Tolerance: ±0.1%; Power(Watts): 100mW; Overload Voltage (Max): 75V; Temperature Coefficient: ±25ppm/℃; Operating Temperature Range: -55℃~+155℃
R26 = RT0603BRD071KL: 电阻类型:薄膜电阻;阻值:1kΩ;精度:±0.1%;功率:100mW;最大工作电压:75V;温度系数:±25ppm/℃;; LCSC Part Name: 薄膜电阻 1kΩ ±0.1% 100mW; Supplier Part: C110776; Manufacturer: YAGEO(国巨); Supplier Footprint: 0603; JLCPCB Part Class: 扩展库; Datasheet: https://atta.szlcsc.com/upload/public/pdf/source/20170704/1499151282044.pdf; Supplier: LCSC; Type: 薄膜电阻; Tolerance: ±0.1%; Power(Watts): 100mW; Overload Voltage (Max): 75V; Temperature Coefficient: ±25ppm/℃; Operating Temperature Range: -55℃~+155℃
R27 = RT0603BRD0710KL: 电阻类型:薄膜电阻;阻值:10kΩ;精度:±0.1%;功率:100mW;最大工作电压:75V;温度系数:±25ppm/℃;; LCSC Part Name: 薄膜电阻 10kΩ ±0.1% 100mW; Supplier Part: C95204; Manufacturer: YAGEO(国巨); Supplier Footprint: 0603; JLCPCB Part Class: 扩展库; Datasheet: https://atta.szlcsc.com/upload/public/pdf/source/20170217/1487301593756.pdf; Supplier: LCSC; Type: 薄膜电阻; Tolerance: ±0.1%; Power(Watts): 100mW; Overload Voltage (Max): 75V; Temperature Coefficient: ±25ppm/℃; Operating Temperature Range: -55℃~+155℃
R30 R33 = RS-03L3R00FT: 电阻类型:厚膜电阻;阻值:3Ω;精度:±1%;功率:100mW;最大工作电压:50V;温度系数:±250ppm/℃;; LCSC Part Name: 厚膜电阻 3Ω ±1% 100mW; Supplier Part: C322143; Manufacturer: FH(风华); Supplier Footprint: 0603; JLCPCB Part Class: Extended Part; Datasheet: https://atta.szlcsc.com/upload/public/pdf/source/20140616/1457707091974.pdf; Supplier: LCSC; Type: 厚膜电阻; Tolerance: ±1%; Power(Watts): 100mW; Overload Voltage (Max): 50V; Temperature Coefficient: ±250ppm/℃; Operating Temperature Range: -55℃~+155℃
R31 = HoJLR2512-3W-10mR-1%: 电阻类型:采样电阻;阻值:10mΩ;精度:±1%;功率:3W;安装方式:贴片;; LCSC Part Name: 10mΩ ±1% 3W; Supplier Part: C2903468; Manufacturer: Milliohm(毫欧); Supplier Footprint: 2512; JLCPCB Part Class: 扩展库; Datasheet: https://atta.szlcsc.com/upload/public/pdf/source/20211009/7525CABAB363C979E942C1DD41F1FEF0.pdf; Supplier: LCSC; Type: 采样电阻; Tolerance: ±1%; Power(Watts): 3W; Mounting Sytle: 贴片
U10 = LMV321_C686637: 放大器数:单路;增益带宽积(GBP):1MHz;输入偏置电流(Ib):10pA;输入失调电压(Vos):800uV;压摆率(SR):0.52V/us;轨到轨:轨到轨输出;; Supplier Part: C686637; Manufacturer: PJSEMI(平晶微); Supplier Footprint: SOT-23-5; JLCPCB Part Class: 扩展库; Datasheet: https://atta.szlcsc.com/upload/public/pdf/source/20220929/93A8F1B98625D31709C749D305A043A1.pdf; Supplier: LCSC; Number of Circuits: 单路; Gain Bandwidth Product(GBP): 1MHz; Current - Input Bias(Ib): 10pA; Voltage - Input Offset(Vos): 800uV; Slew Rate(SR): 0.52V/us; Output Current: 20mA; Supply Voltage: 7.5V; Rail to Rail: 轨到轨输出; Input Offset Voltage Drift (Vos TC): 2.7uV/℃; Operating Temperature: 0℃~+70℃
U11 = TP181A1-CR: Supplier Part: C2902349; Manufacturer: 3PEAK; Supplier Footprint: SC70-6; JLCPCB Part Class: 扩展库; Datasheet: https://atta.szlcsc.com/upload/public/pdf/source/20230301/6D62DABF8769A8088870FFE026FF2C6D.pdf; Supplier: LCSC
U12 U13 = LMV358MM/TR: 放大器数:双路;轨到轨:轨到轨输出;; Supplier Part: C2926391; Manufacturer: HGSEMI(华冠); Supplier Footprint: MSOP-8; JLCPCB Part Class: 扩展库; Datasheet: https://atta.szlcsc.com/upload/public/pdf/source/20210628/C2835216_A5D5184BAB460A1D5A0ECD519F5C588E.pdf; Supplier: LCSC; Number of Circuits: 双路; Rail to Rail: 轨到轨输出
BUZZER1 = HNB09A03: 驱动方式:有源(内含驱动线路);构造类型:电磁式;额定电压:3V;工作电压:1.5V~4.5V;消耗电流:30mA;频率:3kHz;声压(SPL):85dB@10cm;直径(φD):9mm;长度:-;宽度:-;高度:5.5mm;工作温度:-20℃~+70℃;; LCSC Part Name: 电磁式有源一体蜂鸣器HNB09A03; Supplier Part: C96102; Manufacturer: 华能; Supplier Footprint: 插件,D=9mm; Datasheet: https://atta.szlcsc.com/upload/public/pdf/source/20170522/1495448326172.pdf; Supplier: LCSC; Oscillator Circuit: 有源(内含驱动线路); Technology Type: 电磁式; Rated Voltage: 3V; Operating Voltage: 1.5V~4.5V; Current Consumption: 30mA; Sound Pressure Level (SPL): 85dB@10cm; Diameter (φD): 9mm; Height: 5.5mm; Operating Temperature: -20℃~+70℃
C2 C4 = CL10A105KB8NNNC: 容值:1uF;精度:±10%;额定电压:50V;材质(温度系数):X5R;; LCSC Part Name: 1uF ±10% 50V; Supplier Part: C15849; Manufacturer: SAMSUNG(三星); Supplier Footprint: 0603; JLCPCB Part Class: 基础库; Datasheet: https://atta.szlcsc.com/upload/public/pdf/source/20160218/1457707763339.pdf; Supplier: LCSC; Tolerance: ±10%; Voltage Rated: 50V; Temperature Coefficient: X5R
Q1 = S8050 J3Y_C2146: 晶体管类型:NPN;集射极击穿电压(Vceo):25V;集电极电流(Ic):500mA;功率(Pd):300mW;直流电流增益(hFE@Ic,Vce):200@50mA,1V;; LCSC Part Name: NPN 25V 500mA (200-350); Supplier Part: C2146; Manufacturer: CJ(江苏长电/长晶); Supplier Footprint: SOT-23; Datasheet: https://atta.szlcsc.com/upload/public/pdf/source/20140809/1457707209234.pdf; Supplier: LCSC; Transistor Type: NPN; Collector-Emitter Breakdown Voltage (Vceo): 25V; Collector Current (Ic): 500mA; Power Dissipation (Pd): 300mW; Collector Cut-Off Current (Icbo): 100nA; Collector-Emitter Saturation Voltage (VCE(sat)@Ic,Ib): 600mV@500mA,50mA; DC Current Gain (hFE@Ic,Vce): 200@50mA,1V; Transition Frequency (fT): 150MHz; Operating Temperature: +150℃@(Tj)
R1 R3 = 0603WAF1002T5E: 电阻类型:厚膜电阻;阻值:10kΩ;精度:±1%;功率:100mW;; LCSC Part Name: 厚膜电阻 10kΩ ±1% 100mW; Supplier Part: C25804; Manufacturer: UNI-ROYAL(厚声); Supplier Footprint: 0603; JLCPCB Part Class: 基础库; Datasheet: https://atta.szlcsc.com/upload/public/pdf/source/20200306/C422600_1E6D84923E4A46A82E41ADD87F860B5C.pdf; Supplier: LCSC; Type: 厚膜电阻; Tolerance: ±1%; Power(Watts): 100mW; Overload Voltage (Max): 75V; Temperature Coefficient: ±100ppm/℃; Operating Temperature Range: -55℃~+155℃
R2 = 0603WAF1001T5E: 电阻类型:厚膜电阻;阻值:1kΩ;精度:±1%;功率:100mW;最大工作电压:75V;温度系数:±100ppm/℃;; LCSC Part Name: 1kΩ ±1% 100mW 厚膜电阻; Supplier Part: C21190; Manufacturer: UNI-ROYAL(厚声); Supplier Footprint: 0603; JLCPCB Part Class: 基础库; Datasheet: https://atta.szlcsc.com/upload/public/pdf/source/20200306/C422600_1E6D84923E4A46A82E41ADD87F860B5C.pdf; Supplier: LCSC; Type: 厚膜电阻; Tolerance: ±1%; Power(Watts): 100mW; Overload Voltage (Max): 75V; Temperature Coefficient: ±100ppm/℃; Operating Temperature Range: -55℃~+155℃
SW1-SW3 = TS-1009S-03826: 电路结构:单刀单掷;按钮形状:圆形按钮;安装方式:立贴;开关长度:4.5mm;开关宽度:4.5mm;开关高度:3.8mm;触点电流:50mA;额定电压(DC):12V;带灯:-;机械寿命:-;; LCSC Part Name: 4.5*4.5*3.8mm 立贴 轻触开关; Supplier Part: C455243; Manufacturer: XUNPU(讯普); Supplier Footprint: SMD,4.5x4.5mm; JLCPCB Part Class: Extended Part; Datasheet: https://atta.szlcsc.com/upload/public/pdf/source/20191118/C455248_D35D7E271EC7BD44939E7F982BCB1632.pdf; Supplier: LCSC; Circuit: 单刀单掷; Actuator Style: 圆形按钮; Mounting Style: 立贴; Switch Length: 4.5mm; Switch Width: 4.5mm; Switch Height: 3.8mm; Contact Current: 50mA; Voltage Rating (DC): 12V
U1 = 1.8寸TFT屏模块-8Pin: Supplier Part: C2897371; Supplier: 立创商城; Check: false
U2 = LP5907MFX-3.3/NOPB: 输出类型:固定;最大输入电压:5.5V;输出电压:3.3V;输出电流:250mA;电源纹波抑制比(PSRR):90dB@(100Hz)；60dB@(100kHz);输出极性:正极;; LCSC Part Name: 具有低 IQ 和使能功能的 250mA、低噪声、高 PSRR、超低压降稳压器; Supplier Part: C80670; Manufacturer: TI(德州仪器); Supplier Footprint: SOT-23-5; JLCPCB Part Class: 扩展库; Datasheet: https://www.ti.com/cn/lit/gpn/lp5907; Supplier: LCSC; Output Type: 固定; Maximum Input Voltage: 5.5V; Output Voltage: 3.3V; Output Current: 250mA; Power Supply Rejection Ratio (PSRR): 90dB@(100Hz)；60dB@(100kHz); Dropout Voltage: 250mV@(250mA); standby current: 25uA; Feature: 防静电保护；短路保护；自动放电功能；低ESR；热保护(TSD)；欠压闭锁；带使能; Operating Temperature: -40℃~+125℃; Output Polarity: 正极; Number of Outputs: 1

## Nets
+5V: C2.2 C3.2 EVK1.80(+5V0) R2.1 U2.1(IN)
+A3V3: C4.2 C5.2 C8.2 C9.2 C11.2 C13.2 C16.2 D4.1(K) D5.1(K) Q2.2(S) Q3.2(S) Q4.2(S) Q5.2(S) R6.2 R8.2 R10.2 R21.2 R22.2 R23.2 R24.2 U2.5(OUT) U3.5(VCC) U10.5(V+) U11.3(V+) U12.8(VDD) U13.8(VDD)
+D3.3V: BUZZER1.1 C1.2 C6.2 EVK1.78(+3V3) U1.2(VCC)
AGND: C4.1 C5.1 C7.1 C8.1 C9.1 C10.1 C11.1 C12.1 C13.1 C15.1 C16.1 D1.2 D3.1 D6.2 EVK1.37(AGND) R4.2 R7.1 R9.1 R14.1 U3.3(GND) U5.1 U7.2 U9.3(C) U10.2(V-) U11.2(GND) U12.4(VSS) U13.4(VSS)
GND: C1.1 C2.1 C3.1 C6.1 EVK1.77(GND) EVK1.79(GND) Q1.2(E) R3.1 R4.1 SW1.3 SW1.4 SW2.3 SW2.4 SW3.3 SW3.4 U1.1(GND) U2.2(GND)
BLACK_CON: EVK1.36(PD14) U3.1(A)
BLACK_PIN: CN2.5 D1.1 R12.1 R30.1 R31.2 U4.3(D)
BUZZER: EVK1.12(PC5) R1.2
CON_1K: EVK1.18(PE10) Q3.1(G) R22.1
CON_10K: EVK1.20(PE12) Q4.1(G) R23.1
CON_100K: EVK1.16(PE8) Q5.1(G) R24.1
CON_100R: EVK1.17(PE11) Q2.1(G) R21.1
ELECTRICITY_PIN: EVK1.57(PC3) R32.2
KEY1: EVK1.42(PC9) SW1.1 SW1.2
KEY2: EVK1.41(PD3) SW2.1 SW2.2
KEY3: EVK1.1(PA2) SW3.1 SW3.2
PB1/ADC9: EVK1.34(PD12) R34.2 R35.1 U3.2(B)
RES_VCC: R25.1 R26.1 R27.1 R28.1 U7.3 U10.1(+IN)
RESISTANCE_PIN: EVK1.14(PB1) R29.2
SPI_BL: EVK1.3(PA0) U1.8(BL)
SPI_CS: EVK1.4(PA1) U1.7(CS)
SPI_DC: EVK1.5(PA4) U1.6(DC)
SPI_RES: EVK1.6(PA3) U1.5(RES)
SPI_SCL: EVK1.8(PA5) U1.3(SCL)
SPI_SDA: EVK1.10(PA7) U1.4(SDA)
VOL_VCC: R18.1 U8.3
VOLTAGE_PIN: EVK1.56(PC2) R16.2
VREF: C7.2 R15.1 R17.2 R20.2 U11.1(REF) U13.6(INB-) U13.7(OUTB)
$2N583: R2.2 U2.3(EN)
$2N837: Q1.1(B) R1.1 R3.2
$2N838: BUZZER1.2 Q1.3(C)
$3N409: D2.1(K) R5.1 U3.4(Y)
$3N410: D2.2(A) R5.2 R7.2 U4.1(G)
$3N411: U4.2(S) U5.2
$3N879: CN1.5 D3.2 U7.4 U8.4
$3N885: R8.1 U8.1
$3N889: U6.2(E) U7.1
$3N891: R6.1 U6.3(C)
$3N894: U8.2 U9.2(E)
$3N4515: R9.2 R34.1 U6.1(B)
$3N4596: R35.2 U9.1(B)
$4N965: R12.2 R15.2 U12.3(INA+)
$4N967: R17.1 R18.2 U12.5(INB+)
$4N971: R19.1 U12.6(INB-) U12.7(OUTB)
$4N972: R11.1 U12.1(OUTA) U12.2(INA-)
$4N973: R11.2 R13.1 U13.2(INA-)
$4N974: R19.2 R20.1 U13.3(INA+)
$4N985: R10.1 R14.2 U13.5(INB+)
$4N994: C10.2 D4.2(A) R13.2 R16.1 U13.1(OUTA)
$4N1465: C14.1 R33.2 U11.4(IN+)
$4N1466: CN3.5 D6.1 R31.1 R33.1
$4N1467: C14.2 R30.2 U11.5(IN-)
$4N1481: C15.2 R32.1 U11.6(OUT)
$4N2338: Q2.3(D) R25.2
$4N2342: Q3.3(D) R26.2
$4N2344: Q4.3(D) R27.2
$4N2348: Q5.3(D) R28.2
$4N2381: C12.2 D5.2(A) R29.1 U10.3(-IN) U10.4(OUT)

Not connected (* = marked no-connect by the designer): CN1 1* 2* 3* 4*; CN2 1* 2* 3* 4*; CN3 1* 2* 3* 4*; EVK1 2(EXT REF+)* 7(PA6)* 9(PC4)* 11(PB0)* 13(PE7)* 15(PE9)* 19(PE13)* 21(PE15)* 22(PE14)* 23(PB10)* 24(PB11)* 25(PB13)* 26(PB12)* 27(PB15)* 28(PB14)* 29(PD9)* 30(PD8)* 31(PD11)* 32(PD10)* 33(PD13)* 35(PD15)* 38(+3V3)* 39(GND)* 40(+5V0)* 43(PC8)* 44(PC12)* 45(PD2)* 46(PC11)* 47(PC10)* 48(PC13)* 49(PE6)* 50(PE5)* 51(PE4)* 52(PE3)* 53(PE2)* 54(PC0)* 55(PC1)* 58(PE1)* 59(PE0)* 60(PB9)* 61(PB8)* 62(PB7)* 63(PB6)* 64(PB5)* 65(PB4)* 66(EXT-BAT+)* 67(PD7)* 68(PD6)* 69(PD5)* 70(PD4)* 71(PD1)* 72(PD0)* 73(PA15)* 74(PA8)* 75(PC6)* 76(PC7)*; U2 4(N/C)*

## Notes on the sheets
sheet 2
- 1.8寸TFT屏幕模块
- 功能按键
- 模拟电源
- 蜂鸣器
sheet 3
- 负极控制电路
- 电压电阻选通控制
sheet 4
- 0--36V电压测量电路
- 电阻测量电路
- 电流测量电路
